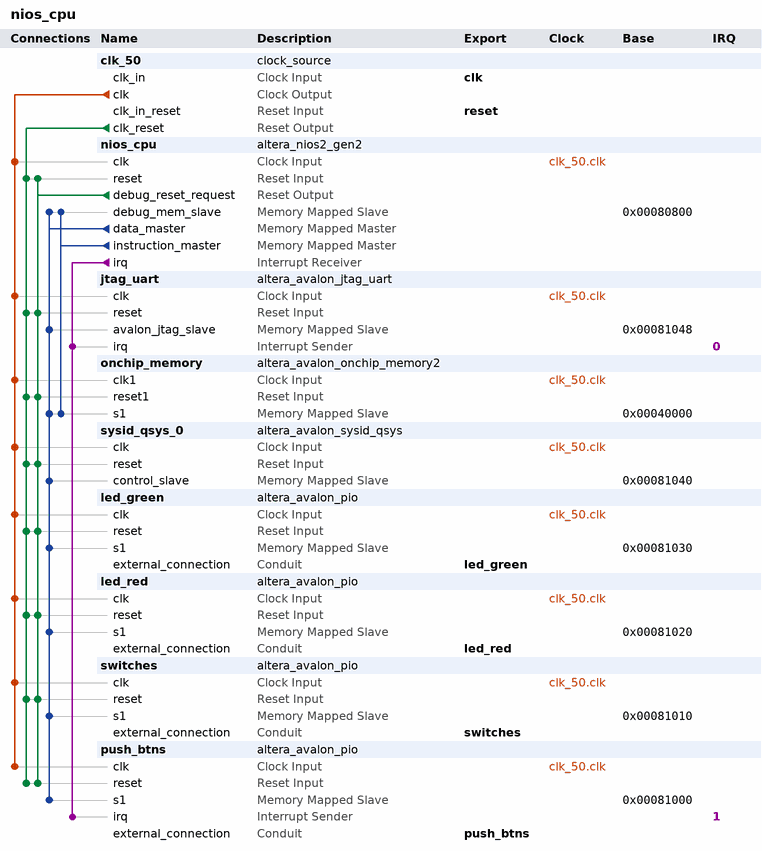
[diagram p0: system contents]
# Platform Designer (Qsys) system nios_cpu, Cyclone IV GX EP4CGX150DF31C7
# Parameters at their usual value, and those the tool derives, are not listed.
package require -exact qsys 16.1
create_system nios_cpu
set_project_property DEVICE_FAMILY {Cyclone IV GX}
set_project_property DEVICE EP4CGX150DF31C7

add_instance clk_50 clock_source 16.1
set_instance_parameter_value clk_50 clockFrequency 50000000

add_instance nios_cpu altera_nios2_gen2 16.1
set_instance_parameter_value nios_cpu dcache_size 2048
set_instance_parameter_value nios_cpu exceptionSlave onchip_memory.s1
set_instance_parameter_value nios_cpu icache_size 4096
set_instance_parameter_value nios_cpu impl Fast
set_instance_parameter_value nios_cpu resetSlave onchip_memory.s1

add_instance jtag_uart altera_avalon_jtag_uart 16.1
set_instance_parameter_value jtag_uart simInteractiveOptions NO_INTERACTIVE_WINDOWS

add_instance onchip_memory altera_avalon_onchip_memory2 16.1
set_instance_parameter_value onchip_memory dataWidth 32
set_instance_parameter_value onchip_memory dualPort false
set_instance_parameter_value onchip_memory initMemContent true
set_instance_parameter_value onchip_memory initializationFileName onchip_mem.hex
set_instance_parameter_value onchip_memory memorySize 204800

add_instance sysid_qsys_0 altera_avalon_sysid_qsys 16.1
set_instance_parameter_value sysid_qsys_0 id 0

add_instance led_green altera_avalon_pio 16.1
set_instance_parameter_value led_green direction Output
set_instance_parameter_value led_green width 8

add_instance led_red altera_avalon_pio 16.1
set_instance_parameter_value led_red direction Output
set_instance_parameter_value led_red width 18

add_instance switches altera_avalon_pio 16.1
set_instance_parameter_value switches direction Input
set_instance_parameter_value switches width 18

add_instance push_btns altera_avalon_pio 16.1
set_instance_parameter_value push_btns direction Input
set_instance_parameter_value push_btns generateIRQ true
set_instance_parameter_value push_btns width 4

# connections
add_connection clk_50.clk jtag_uart.clk clock
add_connection clk_50.clk led_green.clk clock
add_connection clk_50.clk led_red.clk clock
add_connection clk_50.clk nios_cpu.clk clock
add_connection clk_50.clk onchip_memory.clk1 clock
add_connection clk_50.clk push_btns.clk clock
add_connection clk_50.clk switches.clk clock
add_connection clk_50.clk sysid_qsys_0.clk clock
add_connection clk_50.clk_reset jtag_uart.reset reset
add_connection clk_50.clk_reset led_green.reset reset
add_connection clk_50.clk_reset led_red.reset reset
add_connection clk_50.clk_reset nios_cpu.reset reset
add_connection clk_50.clk_reset onchip_memory.reset1 reset
add_connection clk_50.clk_reset push_btns.reset reset
add_connection clk_50.clk_reset switches.reset reset
add_connection clk_50.clk_reset sysid_qsys_0.reset reset
add_connection nios_cpu.debug_reset_request jtag_uart.reset reset
add_connection nios_cpu.debug_reset_request led_green.reset reset
add_connection nios_cpu.debug_reset_request led_red.reset reset
add_connection nios_cpu.debug_reset_request nios_cpu.reset reset
add_connection nios_cpu.debug_reset_request onchip_memory.reset1 reset
add_connection nios_cpu.debug_reset_request push_btns.reset reset
add_connection nios_cpu.debug_reset_request switches.reset reset
add_connection nios_cpu.debug_reset_request sysid_qsys_0.reset reset
add_connection nios_cpu.data_master jtag_uart.avalon_jtag_slave avalon
set_connection_parameter_value nios_cpu.data_master/jtag_uart.avalon_jtag_slave baseAddress 0x00081048
add_connection nios_cpu.data_master led_green.s1 avalon
set_connection_parameter_value nios_cpu.data_master/led_green.s1 baseAddress 0x00081030
add_connection nios_cpu.data_master led_red.s1 avalon
set_connection_parameter_value nios_cpu.data_master/led_red.s1 baseAddress 0x00081020
add_connection nios_cpu.data_master nios_cpu.debug_mem_slave avalon
set_connection_parameter_value nios_cpu.data_master/nios_cpu.debug_mem_slave baseAddress 0x00080800
add_connection nios_cpu.data_master onchip_memory.s1 avalon
set_connection_parameter_value nios_cpu.data_master/onchip_memory.s1 baseAddress 0x00040000
add_connection nios_cpu.data_master push_btns.s1 avalon
set_connection_parameter_value nios_cpu.data_master/push_btns.s1 baseAddress 0x00081000
add_connection nios_cpu.data_master switches.s1 avalon
set_connection_parameter_value nios_cpu.data_master/switches.s1 baseAddress 0x00081010
add_connection nios_cpu.data_master sysid_qsys_0.control_slave avalon
set_connection_parameter_value nios_cpu.data_master/sysid_qsys_0.control_slave baseAddress 0x00081040
add_connection nios_cpu.instruction_master nios_cpu.debug_mem_slave avalon
set_connection_parameter_value nios_cpu.instruction_master/nios_cpu.debug_mem_slave baseAddress 0x00080800
add_connection nios_cpu.instruction_master onchip_memory.s1 avalon
set_connection_parameter_value nios_cpu.instruction_master/onchip_memory.s1 baseAddress 0x00040000
add_connection nios_cpu.irq jtag_uart.irq interrupt
set_connection_parameter_value nios_cpu.irq/jtag_uart.irq irqNumber 0
add_connection nios_cpu.irq push_btns.irq interrupt
set_connection_parameter_value nios_cpu.irq/push_btns.irq irqNumber 1

# exported interfaces
add_interface clk clock sink
set_interface_property clk EXPORT_OF clk_50.clk_in
add_interface led_green conduit end
set_interface_property led_green EXPORT_OF led_green.external_connection
add_interface led_red conduit end
set_interface_property led_red EXPORT_OF led_red.external_connection
add_interface push_btns conduit end
set_interface_property push_btns EXPORT_OF push_btns.external_connection
add_interface reset reset sink
set_interface_property reset EXPORT_OF clk_50.clk_in_reset
add_interface switches conduit end
set_interface_property switches EXPORT_OF switches.external_connection

set_interconnect_requirement {$system} qsys_mm.clockCrossingAdapter HANDSHAKE
set_interconnect_requirement {$system} qsys_mm.enableEccProtection FALSE
set_interconnect_requirement {$system} qsys_mm.insertDefaultSlave FALSE
set_interconnect_requirement {$system} qsys_mm.maxAdditionalLatency 1

save_system nios_cpu.qsys
